# Altium schematic sheet Block_Diagram.SchDoc: AC POWER METER
size 420 x 297 mm; DrawnBy: Truong Giang; DocumentNumber: Learning; SheetNumber: 1; SheetTotal: 6
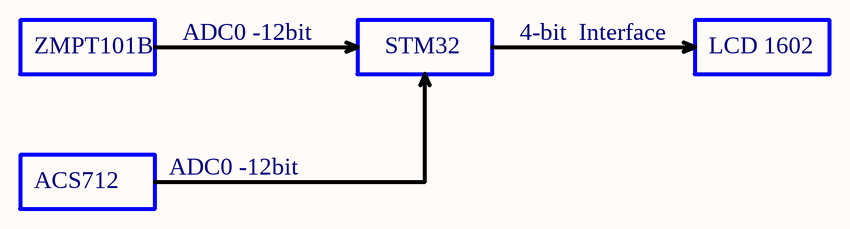
[diagram p0: Block_Diagram.SchDoc]

## Notes on the sheet
- ZMPT101B
- ADC0 -12bit
- STM32
- 4-bit  Interface
- LCD 1602
- ACS712
- PROJECT
- TITLE
- DRAWN BY
- SIZE
- FILE NAME
- SHEET
- OF
- A3